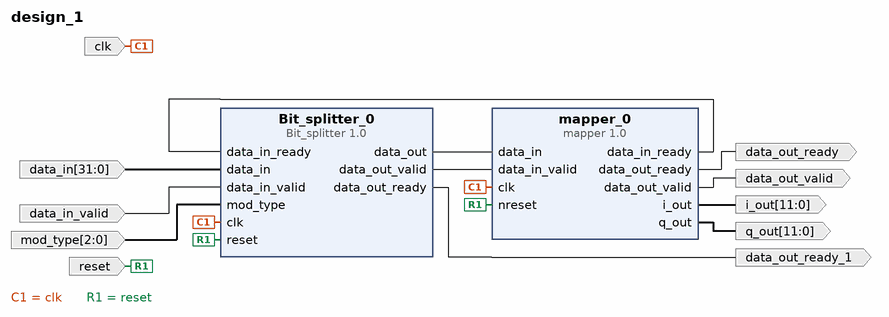
[diagram p0: block diagram of the top level]
# Vivado block design design_1, xczu28dr-ffvg1517-2-e, Vivado 2021.2
create_bd_design design_1

create_bd_port -dir I -type clk clk
set_property -dict {CONFIG.ASSOCIATED_RESET reset} [get_bd_ports clk]
create_bd_port -dir I -from 2 -to 0 mod_type
create_bd_port -dir I -type rst reset
create_bd_port -dir O -from 11 -to 0 i_out
create_bd_port -dir O data_out_ready
create_bd_port -dir O -from 11 -to 0 q_out
create_bd_port -dir O data_out_valid
create_bd_port -dir I -from 31 -to 0 data_in
create_bd_port -dir I data_in_valid
create_bd_port -dir O data_out_ready_1

create_bd_cell -type ip -vlnv user.org:user:mapper:1.0 mapper_0
create_bd_cell -type ip -vlnv user.org:user:Bit_splitter:1.0 Bit_splitter_0

# ---- connections ----

connect_bd_net [get_bd_pins Bit_splitter_0/data_out] [get_bd_pins mapper_0/data_in]
connect_bd_net [get_bd_pins Bit_splitter_0/data_out_ready] [get_bd_ports data_out_ready_1]
connect_bd_net [get_bd_pins Bit_splitter_0/data_out_valid] [get_bd_pins mapper_0/data_in_valid]
connect_bd_net [get_bd_pins mapper_0/data_in_ready] [get_bd_pins Bit_splitter_0/data_in_ready]
connect_bd_net -net clk_0_1 [get_bd_ports clk] [get_bd_pins mapper_0/clk] [get_bd_pins Bit_splitter_0/clk]
connect_bd_net -net data_in_0_1 [get_bd_ports data_in] [get_bd_pins Bit_splitter_0/data_in]
connect_bd_net -net data_in_valid_0_1 [get_bd_ports data_in_valid] [get_bd_pins Bit_splitter_0/data_in_valid]
connect_bd_net [get_bd_pins mapper_0/data_out_ready] [get_bd_ports data_out_ready]
connect_bd_net [get_bd_pins mapper_0/data_out_valid] [get_bd_ports data_out_valid]
connect_bd_net [get_bd_pins mapper_0/i_out] [get_bd_ports i_out]
connect_bd_net [get_bd_pins mapper_0/q_out] [get_bd_ports q_out]
connect_bd_net -net mod_type_0_1 [get_bd_ports mod_type] [get_bd_pins Bit_splitter_0/mod_type]
connect_bd_net -net reset_0_1 [get_bd_ports reset] [get_bd_pins mapper_0/nreset] [get_bd_pins Bit_splitter_0/reset]

validate_bd_design
save_bd_design
